# EAGLE design led-er-breakout-single (EAGLE 7.2.0)
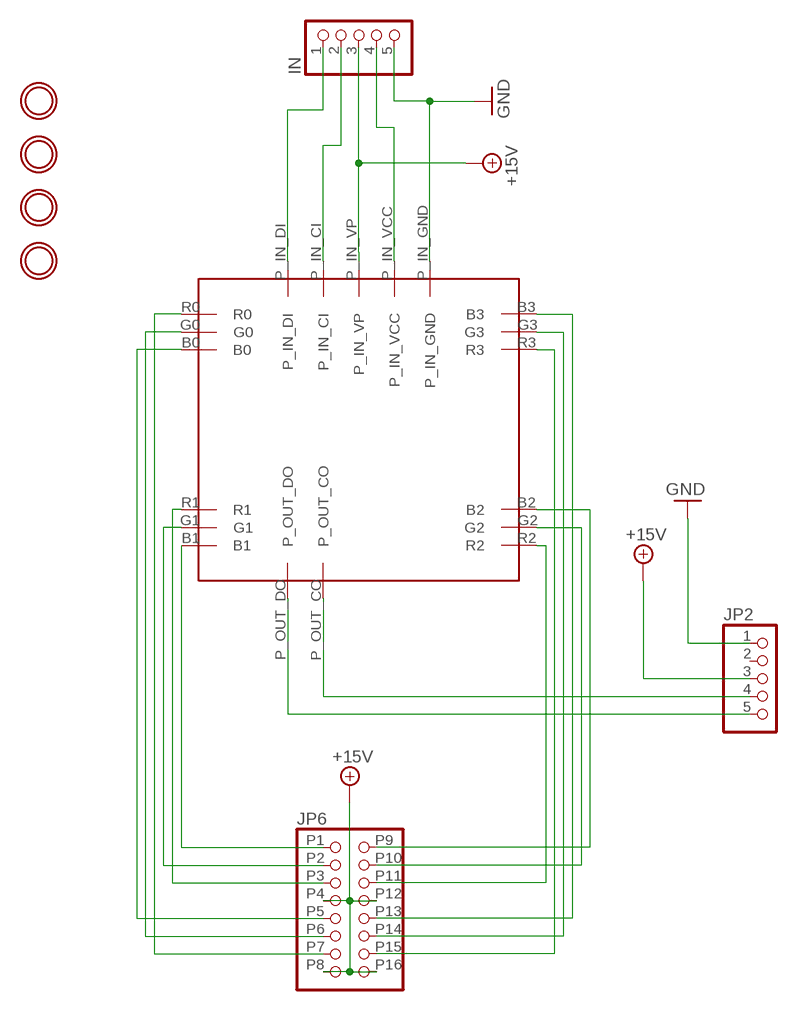
[diagram p0: schematic, sheet 1]

## Parts
IN  HEADER-1X5  [1X05_OVAL]
JP2  HEADER-1X5  [1X05_OVAL]
JP6  HEADER-2X8  [2X08]
U$1  MOUNTINGHOLE2.0  [MOUNTINGHOLE_2.0_PLATED]
U$2  MOUNTINGHOLE2.0  [MOUNTINGHOLE_2.0_PLATED]
U$3  MOUNTINGHOLE2.0  [MOUNTINGHOLE_2.0_PLATED]
U$4  MOUNTINGHOLE2.0  [MOUNTINGHOLE_2.0_PLATED]
U$6  TLC59711_BREAKOUT  [TLC59711_BREAKOUT]

## Nets
+15V: IN.3 JP2.3 JP6.P4 JP6.P8 JP6.P12 JP6.P16 U$6.P_IN_VP
GND: IN.5 JP2.1 U$6.P_IN_GND
N$1: JP6.P3 U$6.R1
N$2: JP6.P2 U$6.G1
N$3: JP6.P1 U$6.B1
N$4: JP6.P7 U$6.R0
N$5: JP6.P6 U$6.G0
N$6: JP6.P5 U$6.B0
N$7: JP6.P15 U$6.R3
N$8: JP6.P14 U$6.G3
N$9: JP6.P13 U$6.B3
N$10: JP6.P11 U$6.R2
N$11: JP6.P10 U$6.G2
N$12: JP6.P9 U$6.B2
N$15: IN.4 U$6.P_IN_VCC
N$16: IN.2 U$6.P_IN_CI
N$17: IN.1 U$6.P_IN_DI
N$19: JP2.4 U$6.P_OUT_CO
N$20: JP2.5 U$6.P_OUT_DO
Unconnected: JP2.2

## Library data of the parts
IN JP2 = microbuilder:HEADER-1X5: PIN HEADER
JP6 = Andrews:HEADER-2X8: 2x8 shrouded header
U$1-U$4 = microbuilder:MOUNTINGHOLE: Mounting Hole For #2 screws (0.086"/2.18mm width, 0.094"/2.4mm hole) use 2.5mm
U$6 = Andrews:TLC59711_BREAKOUT: Adafruit TLC59711 breakout board footprint

## Board
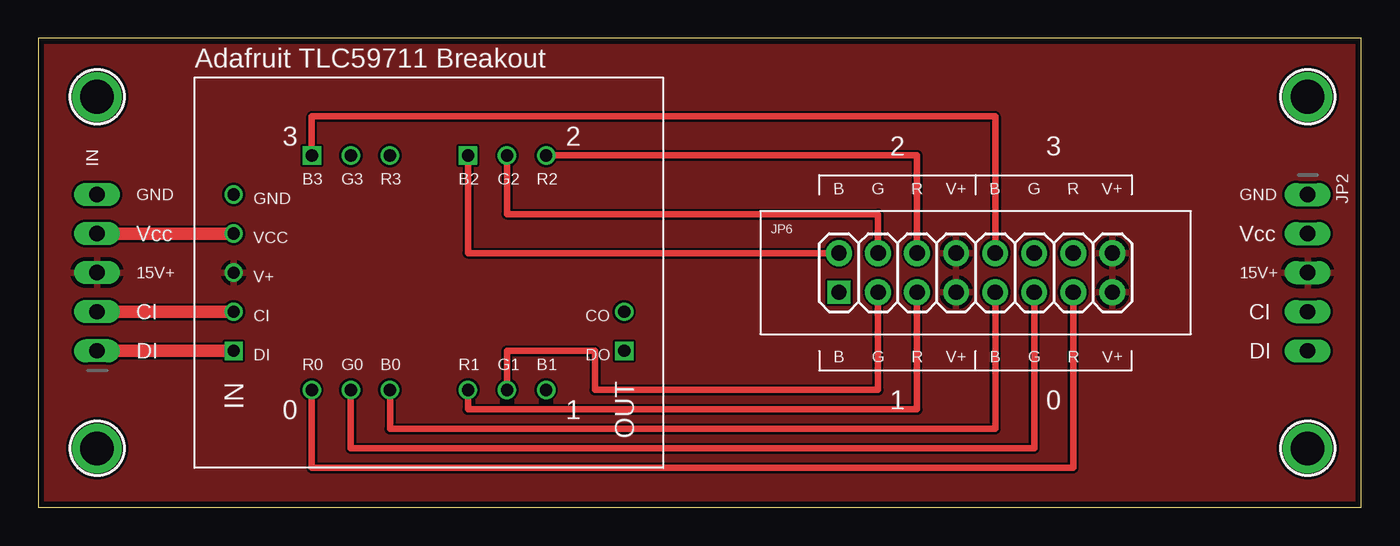
[diagram p1: board, top side]
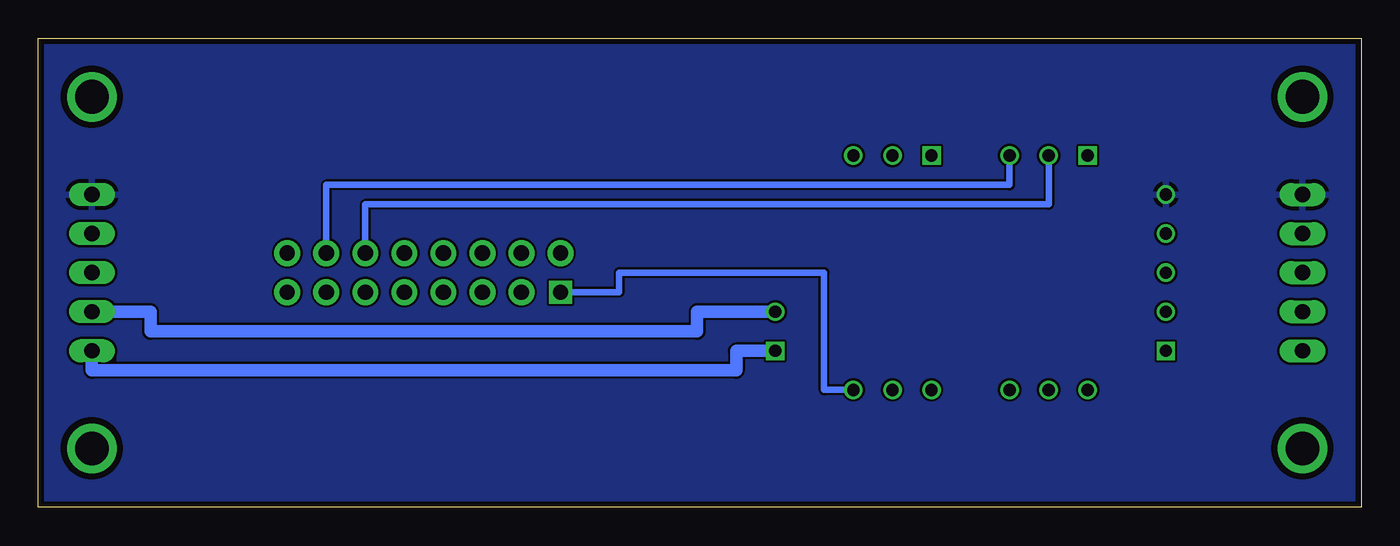
[diagram p2: board, bottom side, seen from below]

Size 86.03 x 30.47 mm. Coordinates in mm from the lower left corner, seen from the top.
Outline: 0,0 86.03,0 86.03,30.47 0,30.47 0,0
Copper layers (1*16): Top 0.0356mm / dielectric 1.5011mm / Bottom 0.0356mm
Design rules "batchpcb": minimum track width 6mil, minimum drill 13mil, track to track 6mil, track to pad 6mil, pad to pad 6mil, via to via 6mil, smd to smd 6mil, copper to edge 15mil, drill to drill 6mil, minimum pad ring 7mil, minimum via ring 7mil, stop-mask expansion 3mil, vias tented up to drill 0mil, thermal gap 10mil

### Footprints (pad centres in the part's own frame; a part is rotated, then mirrored left to right if it is on the bottom)
1X05_OVAL = drill 1 long: 1 -5.08,0; 2 -2.54,0; 3 0,0; 4 2.54,0; 5 5.08,0
2X08 = drill 1 square: P1 -8.89,-1.27 | drill 1 pad 1.676: P2 -6.35,-1.27; P3 -3.81,-1.27; P4 -1.27,-1.27; P5 1.27,-1.27; P6 3.81,-1.27; P7 6.35,-1.27; P8 8.89,-1.27; P9 -8.89,1.27; P10 -6.35,1.27; P11 -3.81,1.27; P12 -1.27,1.27; P13 1.27,1.27; P14 3.81,1.27; P15 6.35,1.27; P16 8.89,1.27
MOUNTINGHOLE_2.0_PLATED = drill 2.2 pad 3: P$1 0,0
TLC59711_BREAKOUT = drill 0.8: B0 -2.54,-7.62; B1 7.62,-7.62; G0 -5.08,-7.62; G1 5.08,-7.62; G2 5.08,7.62; G3 -5.08,7.62; P_IN_CI -12.7,-2.54; P_IN_GND -12.7,5.08; P_IN_VCC -12.7,2.54; P_IN_VP -12.7,0; P_OUT_CO 12.7,-2.54; R0 -7.62,-7.62; R1 2.54,-7.62; R2 7.62,7.62; R3 -2.54,7.62 | drill 0.8 square: B2 2.54,7.62; B3 -7.62,7.62; P_IN_DI -12.7,-5.08; P_OUT_DO 12.7,-5.08

### Placement (x,y rotation side)
IN  3.81,15.24 90 top
JP2  82.55,15.24 270 top
JP6  60.96,15.24 0 top
U$1  3.81,26.67 0 top
U$2  3.81,3.81 0 top
U$3  82.55,3.81 0 top
U$4  82.55,26.67 0 top
U$6  25.4,15.24 0 top

### Tracks (layer width: path | path; a pad name or v marks a point on that pad's centre or on a via)
+15V
  pour Top: 0,30.48 0,0 86.36,0 86.36,30.48
GND
  pour Bottom: 0,30.48 0,0 86.36,0 86.36,30.48
N$1
  Top 0.406: U$6.R1 27.94,6.35 57.15,6.35 JP6.P3
N$2
  Top 0.406: U$6.G1 30.48,10.16 36.2,10.16 36.2,7.62 54.61,7.62 JP6.P2
N$3
  Bottom 0.406: U$6.B1 34.92,7.62 34.92,15.24 48.26,15.24 48.26,13.97 JP6.P1
N$4
  Top 0.406: U$6.R0 17.78,2.54 67.31,2.54 JP6.P7
N$5
  Top 0.406: U$6.G0 20.32,3.81 64.77,3.81 JP6.P6
N$6
  Top 0.406: U$6.B0 22.86,5.08 62.23,5.08 JP6.P5
N$7
  Bottom 0.406: U$6.R3 22.86,20.95 67.31,20.95 JP6.P15
N$8
  Bottom 0.406: U$6.G3 20.32,19.68 64.77,19.68 JP6.P14
N$9
  Top 0.406: U$6.B3 17.78,25.4 62.23,25.4 JP6.P13
N$10
  Top 0.406: U$6.R2 57.15,22.86 JP6.P11
N$11
  Top 0.406: U$6.G2 30.48,19.05 54.61,19.05 JP6.P10
N$12
  Top 0.406: U$6.B2 27.94,16.51 JP6.P9
N$15
  Top 0.813: IN.4 U$6.P_IN_VCC
N$16
  Top 0.813: IN.2 U$6.P_IN_CI
N$17
  Top 0.813: IN.1 U$6.P_IN_DI
N$19
  Bottom 0.813: U$6.P_OUT_CO 43.18,12.7 43.18,11.43 78.74,11.43 78.74,12.7 JP2.4
N$20
  Bottom 0.813: U$6.P_OUT_DO 40.64,10.16 40.64,8.89 82.55,8.89 JP2.5

### Text on the board
tPlace: 2 | 3 | GND | B | G | R | V+ | B | G | R | V+ | GND | Vcc | Vcc | 15V+ | 15V+ | CI | CI | DI | B | G | R | V+ | B | G | R | V+ | DI | 1 | 0